# Altium schematic sheet MP-USBA.SchDoc
size A4; SheetNumber: 6; SheetTotal: 7
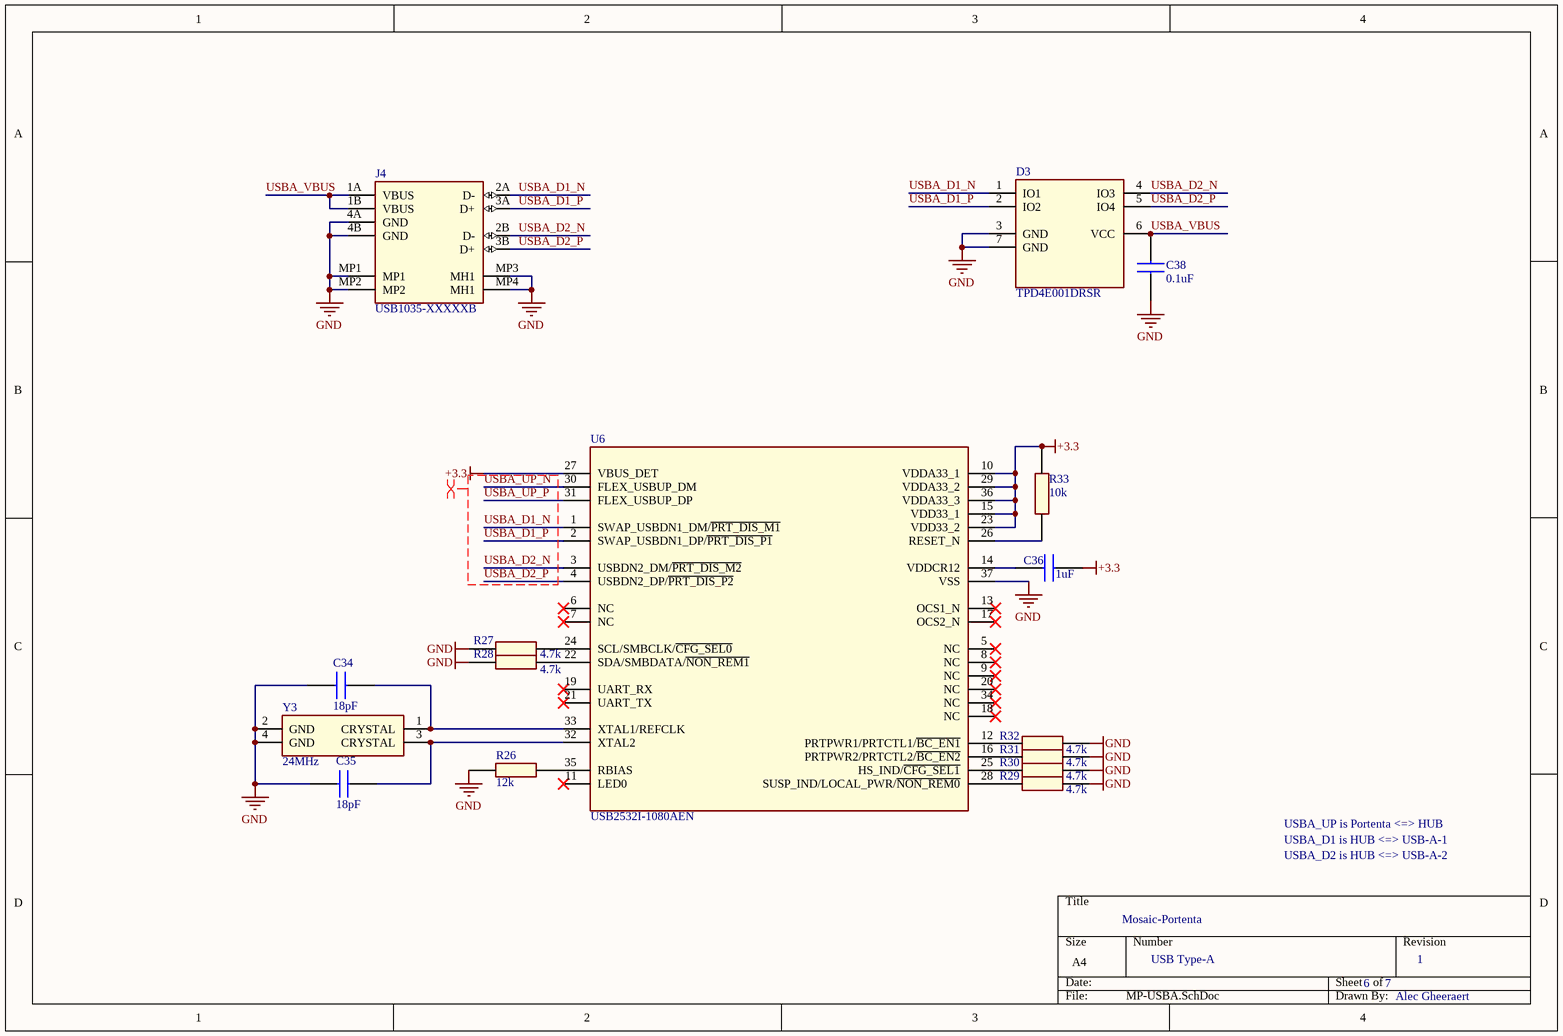
[diagram p0: MP-USBA.SchDoc]

## Parts
C34  18pF  [CAPC1608X87N]
C35  18pF  [CAPC1608X87N]
C36  1uF  [CAPC1608X100N]
C38  0.1uF  [CAPC1005X55N]
D3  TPD4E001DRSR  [SON95P300X300X80-7N-D]
J4  USB1035-XXXXXB  [USB1035-XXXXXB]
R26  12k  [RESC1005X40N]
R27  4.7k  [RESC1005X40N]
R28  4.7k  [RESC1005X40N]
R29  4.7k  [RESC1005X40N]
R30  4.7k  [RESC1005X40N]
R31  4.7k  [RESC1005X40N]
R32  4.7k  [RESC1005X40N]
R33  10k  [RESC1005X40N]
U6  USB2532I-1080AEN  [QFN50P600X600X100-37N-D]
Y3  24MHz  [LFXTAL071257Reel]

## Nets
+3.3: C36.2 R33.2 U6.10(VDDA33_1) U6.15(VDD33_1) U6.23(VDD33_2) U6.27(VBUS_DET) U6.29(VDDA33_2) U6.36(VDDA33_3)
GND: C34.2 C35.2 C38.2 D3.3(GND) D3.7(GND) J4.4A(GND) J4.4B(GND) J4.MP1 J4.MP2 J4.MP3(MH1) J4.MP4(MH1) R26.2 R27.2 R28.2 R29.2 R30.2 R31.2 R32.2 U6.37(VSS) Y3.2(GND) Y3.4(GND)
USBA_D1_N: D3.1(IO1) J4.2A(D-) U6.1(SWAP_USBDN1_DM/~{PRT_DIS_M1})
USBA_D1_P: D3.2(IO2) J4.3A(D+) U6.2(SWAP_USBDN1_DP/~{PRT_DIS_P1})
USBA_D2_N: D3.4(IO3) J4.2B(D-) U6.3(USBDN2_DM/~{PRT_DIS_M2})
USBA_D2_P: D3.5(IO4) J4.3B(D+) U6.4(USBDN2_DP/~{PRT_DIS_P2})
USBA_UP_N: U6.30(FLEX_USBUP_DM)
USBA_UP_P: U6.31(FLEX_USBUP_DP)
USBA_VBUS: C38.1 D3.6(VCC) J4.1A(VBUS) J4.1B(VBUS)
NetC34_1: C34.1 U6.33(XTAL1/REFCLK) Y3.1(CRYSTAL)
NetC35_1: C35.1 U6.32(XTAL2) Y3.3(CRYSTAL)
NetC36_1: C36.1 U6.14(VDDCR12)
NetR26_1: R26.1 U6.35(RBIAS)
NetR27_1: R27.1 U6.24(SCL/SMBCLK/~{CFG_SEL0})
NetR28_1: R28.1 U6.22(SDA/SMBDATA/~{NON_REM1})
NetR29_1: R29.1 U6.28(SUSP_IND/LOCAL_PWR/~{NON_REM0})
NetR30_1: R30.1 U6.25(HS_IND/~{CFG_SEL1})
NetR31_1: R31.1 U6.16(PRTPWR2/PRTCTL2/~{BC_EN2})
NetR32_1: R32.1 U6.12(PRTPWR1/PRTCTL1/~{BC_EN1})
NetR33_1: R33.1 U6.26(RESET_N)

Not connected (* = marked no-connect by the designer): U6 5(NC)* 6(NC)* 7(NC)* 8(NC)* 9(NC)* 11(LED0)* 13(OCS1_N)* 17(OCS2_N)* 18(NC)* 19(UART_RX)* 20(NC)* 21(UART_TX)* 34(NC)*

## Layout directives
differential pair; net class USBA; differential pair class USB: USBA_D1_N, USBA_D1_P, USBA_D2_N, USBA_D2_P, USBA_UP_N, USBA_UP_P

## Notes on the sheet
- USBA_UP is Portenta <=> HUB
- USBA_D1 is HUB <=> USB-A-1
- Mosaic-Portenta
- USBA_D2 is HUB <=> USB-A-2
- USB Type-A
- 6
- 7
- 1
- Alec Gheeraert

## Library data of the parts
C34 C35 = CMP-00052-2: 0603 18pF; Manufacturer: Walsin; Dielectric: C0G; Tolerance: 5%; Voltage Rating: 16V; Max Operating Temperature: 125; Package: 0603; Min Operating Temperature: -55; Capacitance: 18pF
C36 = CMP-00064-1: 0603 1µF; Manufacturer: Walsin; Tolerance: 10%; Dielectric: X5R; Voltage Rating: 6.3V; Package: 0603; Min Operating Temperature: -55; Max Operating Temperature: 85; Capacitance: 1µF
C38 = CMP-00051-3: 0402I 0.1µF; Manufacturer: Walsin; Tolerance: 10%; Dielectric: X7R; Capacitance: 100nF; Voltage Rating: 10V; Min Operating Temperature: -55; Package: 0402; Max Operating Temperature: 125
D3 = CMP-00076-3: 4-Channel TVS Diodes; Channels: 4; Clamping Voltage: 25V; Breakdown Voltage: 11V; Working Voltage: 5.5V; Peak Pulse Current: 5.5A; Polarity: Unidirectional; Min Operating Temperature: -40; Package: WSON-6; Max Operating Temperature: 85
J4 = CMP-00038-9: USB-2.0 Type A Dual; Manufacturer: Global Connector Technologies; Current Rating: 1.8A; Gender: Female; Voltage Rating: 30V; Mounting Angle: Right; USB Type: A; Standard: 2.0; Mounting Style: PCB Mount
R26 = CMP-00068-1: 0402I 12k; Manufacturer: Walsin; Power Rating: 62.5mW; Tolerance: 1%; Qualification: AEC-Q200; Voltage Rating: 50V; Max Operating Temperature: 155; Resistance: 12k; Package: 0402; Min Operating Temperature: -55
R27-R32 = CMP-00030-4: 0402I 4.7k; Manufacturer: Walsin; Power Rating: 62.5mW; Qualification: AEC-Q200; Voltage Rating: 50V; Tolerance: 1%; Max Operating Temperature: 155; Package: 0402; Min Operating Temperature: -55; Resistance: 4.7k
R33 = CMP-00026-5: 0402I 10k; Manufacturer: Walsin; Qualification: AEC-Q200; Tolerance: 1%; Voltage Rating: 50V; Power Rating: 62.5mW; Max Operating Temperature: 155; Resistance: 10k; Package: 0402; Min Operating Temperature: -55
U6 = CMP-00071-2: 2-Port USB-2.0 Controller Hub; Manufacturer: Microchip; Ports: 2; Data Rate: 480Mb/s; Package: SQFN-36; Standard: USB 2.0
Y3 = CMP-00067-2: 24MHz +/-100ppm Crystal; Manufacturer: IQD; Qualification: AEC-Q200; Tolerance: 10; Drive Level: 100µW; ESR: 100; Load Capacitance: 10pF; Min Operating Temperature: -40; Package: 2mm x 1.6mm; Frequency: 24MHz; Max Operating Temperature: 125